# EAGLE design loa_power (EAGLE 5.10)
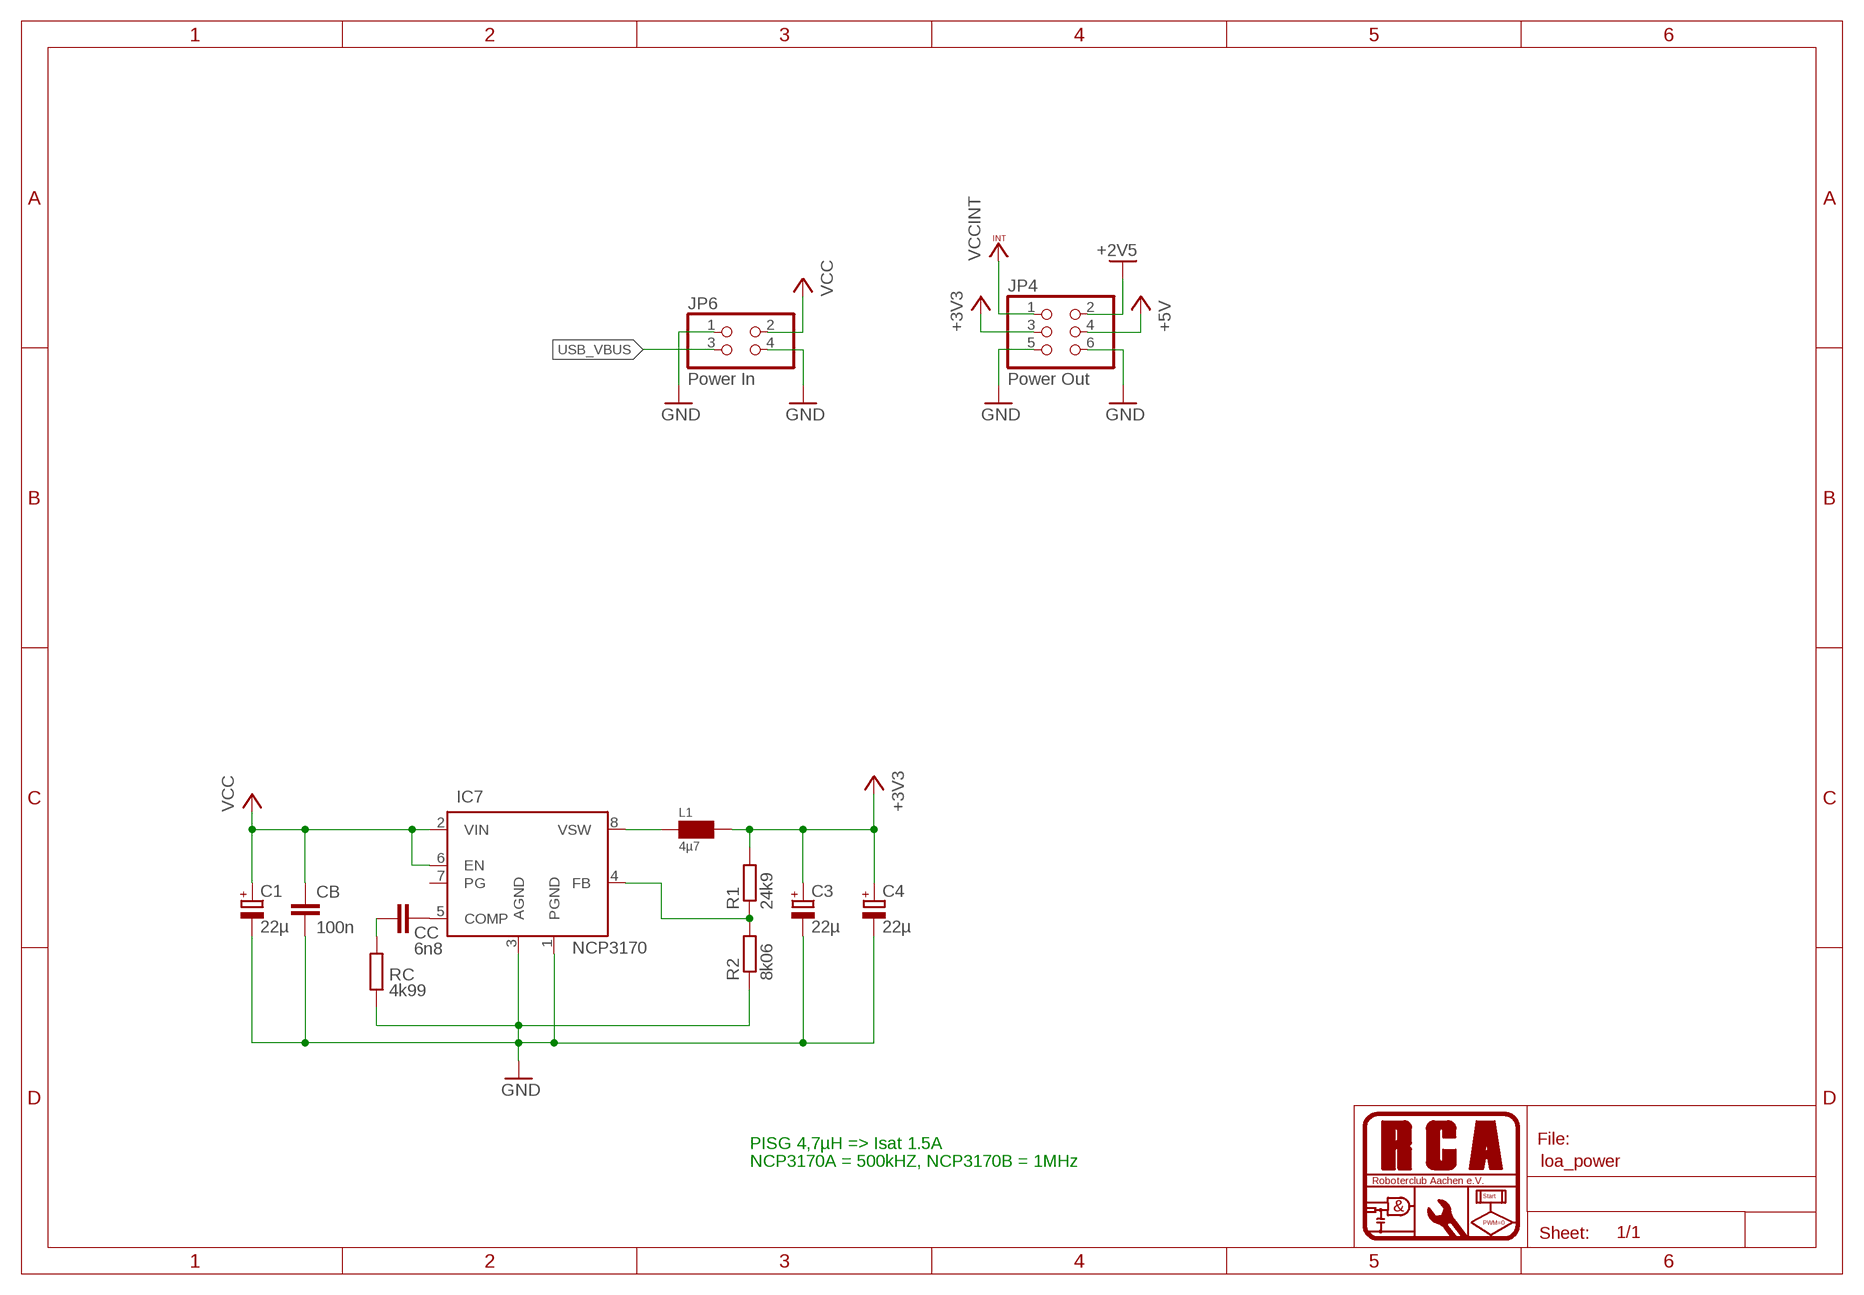
[diagram p0: schematic, sheet 1]

## Parts
C1  22µ  CPOL-EUSMCD  [SMC_D]
C3  22µ  CPOL-EUSMCC  [SMC_C]
C4  22µ  CPOL-EUSMCC  [SMC_C]
CB  100n  C-EUC0805  [C0805]
CC  6n8  C-EUC0805  [C0805]
IC7  NCP3170  [SO08]
JP4  Power Out  PINHD-2X3_2.54  [2X03]
JP6  Power In  PINHD-2X2_2.54  [2X02]
L1  4µ7  INDUCTOR-PISG  [L-PISG]
R1  24k9  R-EU_M0805  [M0805]
R2  8k06  R-EU_M0805  [M0805]
RC  4k99  R-EU_M0805  [M0805]

## Nets
+2V5: JP4.2
+3V3: C3.+ C4.+ JP4.3 L1.2 R1.2
+5V: JP4.4
GND: C1.- C3.- C4.- CB.2 IC7.1(PGND) IC7.3(AGND) JP4.5 JP4.6 JP6.1 JP6.4 R2.1 RC.1
N$1: CC.2 RC.2
N$2: CC.1 IC7.5(COMP)
N$4: IC7.8(VSW) L1.1
N$5: IC7.4(FB) R1.1 R2.2
USB_VBUS: JP6.3
VCC: C1.+ CB.1 IC7.2(VIN) IC7.6(EN) JP6.2
VCCINT: JP4.1
Unconnected: IC7.7(PG)

## Notes on the sheet
- PISG 4,7µH => Isat 1.5A
- NCP3170A = 500kHZ, NCP3170B = 1MHz

## Library data of the parts
C1 C3 C4 = rcl:CPOL-EU: POLARIZED CAPACITOR, European symbol
CB CC = rcl:C-EU: CAPACITOR, European symbol
IC7 = rca_spgversorgung:NCP3170: Synchronous PWM Switching Converter The NCP3170 is a flexible synchronous PWM Switching Buck Regulator. The NCP3170 operates from 4.5V to 18V, sourcing up to 3A and is capable of producing output voltages as low as 0.8V. The NCP3170 also incorporates current mode control. To reduce the number of external components, a number of features are internally set including soft start, power good detection, and switching frequency. The NCP3170 is currently available in an SOIC-8 package.
JP4 = pinhead2:PINHD-2X3: PIN HEADER
JP6 = pinhead2:PINHD-2X2: PIN HEADER
L1 = rca_sontiges:INDUCTOR: SMD-Power-Induktivitäten z.B. PISM, Ferrit, 150µ, Reichelt Bestellnr.: L-PISM 150µ
R1 R2 RC = rcl:R-EU_: RESISTOR, European symbol

## Board
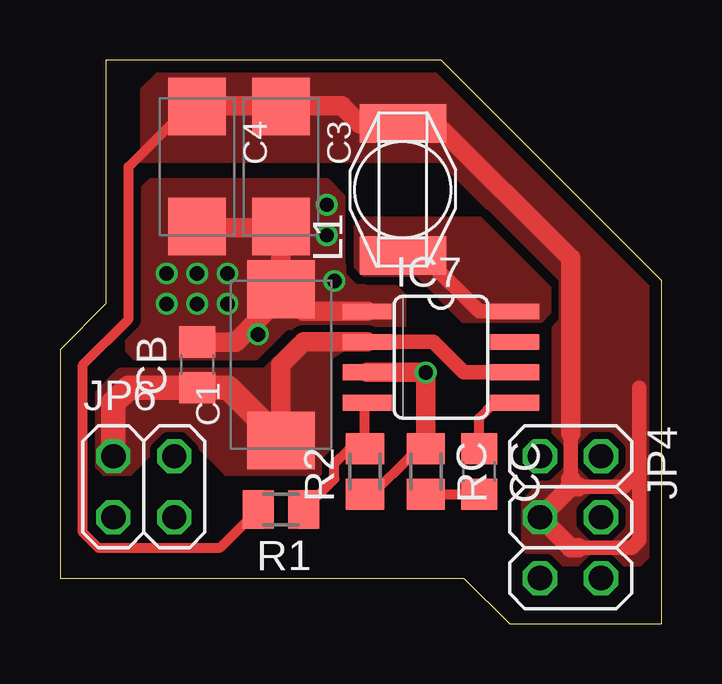
[diagram p1: board, top side]
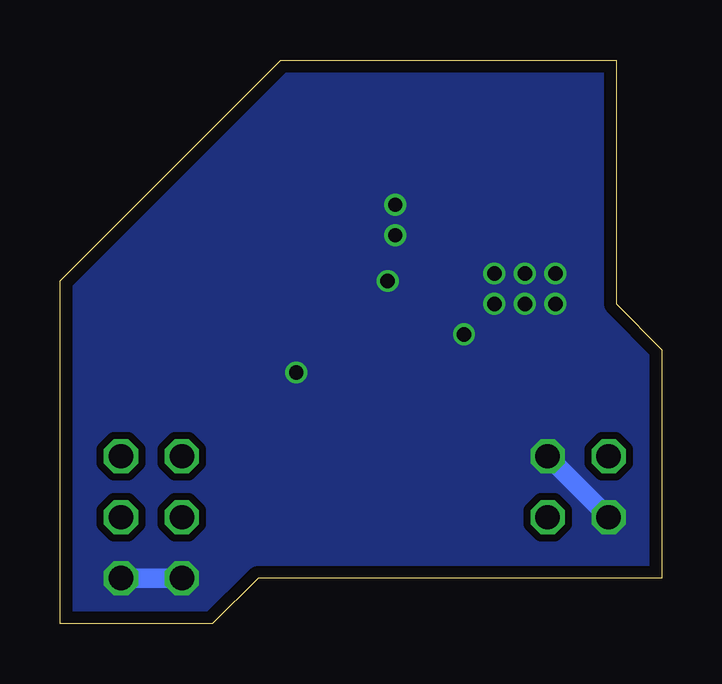
[diagram p2: board, bottom side, seen from below]

Size 25.08 x 23.5 mm. Coordinates in mm from the lower left corner, seen from the top.
Outline: 0,1.9 16.83,1.9 18.73,0 25.08,0 25.08,14.29 15.87,23.5 1.91,23.5 1.91,13.33 0,11.43 0,1.9
Copper layers (1*16): Top 0.035mm / dielectric 1.5mm / Bottom 0.035mm
Design rules "PCB-POOL": minimum track width 6mil, minimum drill 12mil, track to track 6mil, track to pad 6mil, pad to pad 6mil, via to via 6mil, smd to smd 6mil, copper to edge 20mil, drill to drill 8mil, minimum pad ring 8mil, minimum via ring 6mil, stop-mask expansion 3mil, vias tented up to drill 0mil, thermal gap 8mil

### Footprints (pad centres in the part's own frame; a part is rotated, then mirrored left to right if it is on the bottom)
SMC_D = smd 2.4 x 2.8: + -3.15,0; - 3.15,0
SMC_C = smd 2.4 x 2.4: + -2.5,0; - 2.5,0
C0805 = smd 1.3 x 1.5: 1 -0.95,0; 2 0.95,0
SO08 = smd 0.66 x 2.032: 1 -1.905,-3.073; 2 -0.635,-3.073; 3 0.635,-3.073; 4 1.905,-3.073; 5 1.905,3.073; 6 0.635,3.073; 7 -0.635,3.073; 8 -1.905,3.073
2X03 = drill 1.016 octagon: 1 -2.54,-1.27; 2 -2.54,1.27; 3 0,-1.27; 4 0,1.27; 5 2.54,-1.27; 6 2.54,1.27
2X02 = drill 1.016 octagon: 1 -1.27,-1.27; 2 -1.27,1.27; 3 1.27,-1.27; 4 1.27,1.27
L-PISG = smd 1.6 x 3.6: 1 -2.75,0; 2 2.75,0
M0805 = smd 1.3 x 1.6: 1 -0.95,0; 2 0.95,0

### Placement (x,y rotation side)
C1  9.21,10.79 90 top
C3  9.21,19.05 270 top
C4  5.71,19.05 270 top
CB  5.71,10.79 90 top
CC  17.46,6.35 270 top
IC7  15.88,11.11 270 top
JP4  21.27,4.44 270 top
JP6  3.49,5.71 0 top
L1  14.29,18.1 90 top
R1  9.21,4.76 180 top
R2  12.7,6.35 90 top
RC  15.24,6.35 270 top

### Tracks (layer width: path | path; a pad name or v marks a point on that pad's centre or on a via)
+3V3
  Top 0.406: R1.2 6.67,3.18 1.59,3.18 0.95,3.81 0.95,10.79 2.86,12.7 2.86,19.05 5.4,21.59 C4.+
  Top 0.61: 21.27,7.94 21.27,6.03 | 21.59,5.71 23.5,5.71 24.13,6.35 | 24.13,6.35 24.13,9.84 | 21.59,3.18 23.81,3.18 24.13,3.49 24.13,6.35
  Top 0.813: C4.+ 5.76,21.59 9.21,21.59 C3.+ 9.25,21.59 11.75,21.59 12.49,20.85 L1.2 15.66,20.85 21.27,15.24 21.27,7.94 | 21.27,5.71 JP4.3 21.27,3.18 21.59,3.18 | 21.27,6.03 21.27,5.71 | 21.27,5.71 21.59,5.71
  pour Top (isolate 0.305, rank 5, no thermals): 3.49,22.22 3.49,20 3.49,19.68 3.18,19.37 15.88,19.37 20.64,14.61 20.64,6.35 19.37,5.08 19.37,3.18 20,2.54 24.13,2.54 24.76,3.18 24.76,16.19 18.1,22.86 4.13,22.86
GND  (via drill 0.6)
  Top 0.406: R2.1 13.02,5.4 14.6,6.99 14.93,6.99 RC.1
  Top 0.813: IC7.1 10.14,13.02 C1.- | C4.- 5.99,16.55 6.03,16.51 9.17,16.51 C3.- C1.- | CB.2 7.32,11.75 9.21,13.65 C1.- | IC7.3 v15.24,10.48 RC.1
  Bottom 0.813: JP6.1 JP6.4 | JP4.5 JP4.6
  other vias: 4.45,14.61 5.71,14.61 6.98,14.61 4.45,13.33 5.71,13.33 6.98,13.33 11.11,17.46 11.11,16.19 11.43,14.29 8.25,12.07
  pour Bottom (isolate 0.305, no thermals): -1.59,-1.91 26.99,-1.91 26.99,26.04 -1.59,26.04
  pour Top (isolate 0.305, rank 6, no thermals): 2.86,11.43 3.49,10.79 8.25,10.79 9.53,12.07 13.97,12.07 14.29,12.38 14.29,13.65 13.97,13.97 12.7,13.97 11.75,14.92 11.75,17.78 11.11,18.42 3.81,18.42 2.86,17.46
N$1
  Top 0.406: RC.2 CC.2
N$2
  Top 0.406: CC.1 17.46,8.57 18.1,9.21 IC7.5
N$4
  Top 0.61: IC7.8 17.46,13.02 15.24,15.24 15.24,15.45 L1.1
  pour Top (isolate 0.305, no thermals): 12.38,16.51 12.38,14.92 12.7,14.61 14.92,14.61 16.83,12.7 20,12.7 20.32,13.02 20.32,13.97 17.46,16.83 12.7,16.83
N$5
  Top 0.406: IC7.4 12.7,9.21 R2.2 12.06,7.3 11.43,6.67 11.43,6.03 10.8,5.4 10.48,5.08 R1.1
VCC
  Top 0.61: IC7.2 15.56,11.75 16.83,10.48 IC7.6
  Top 0.813: IC7.2 10.16,11.75 9.21,10.79 C1.+
  Top 1.016: JP6.2 2.22,9.21 2.86,9.84 CB.1 7.01,9.85 C1.+
  pour Top (isolate 0.305, no thermals): 1.59,9.53 2.54,10.48 8.57,10.48 9.84,11.75 12.07,11.75 11.11,11.11 11.11,6.67 10.8,6.35 6.98,6.35 5.71,7.62 4.13,7.62 2.86,6.35 1.91,6.35 1.59,6.67